# Altium project UART.PrjPCB
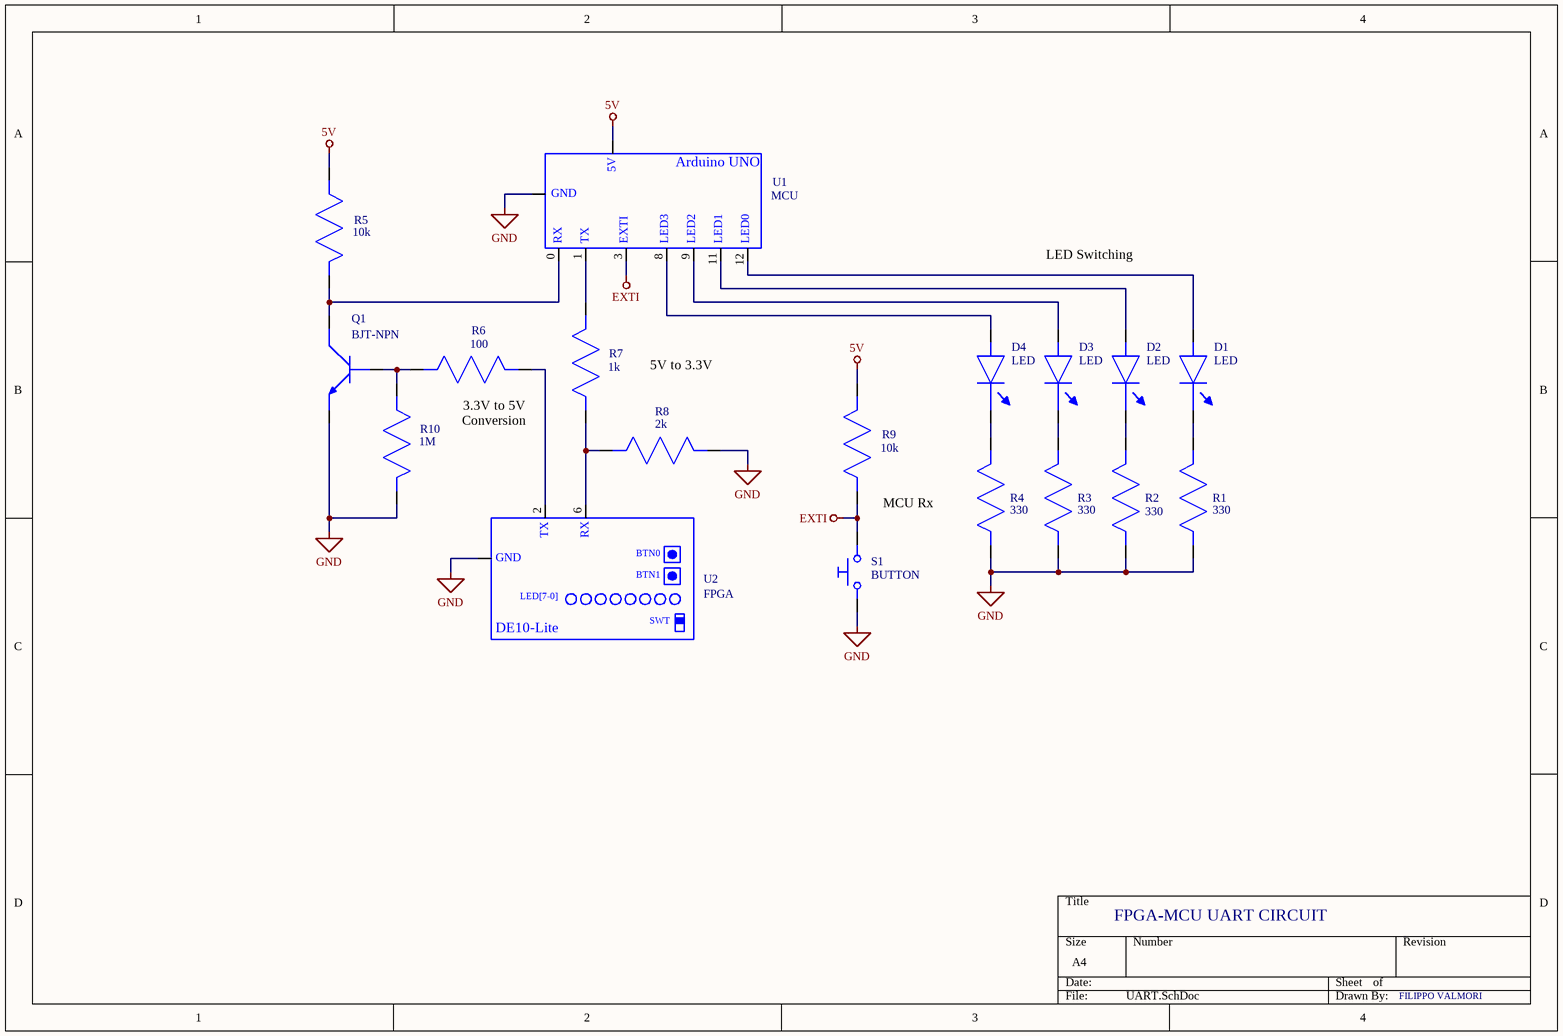
[diagram p0: UART.SchDoc]
2 sheets, 21 parts. Net scope: global (net labels, ports and power ports of the same name join across sheets).
Sheets:
  UART.SchDoc
  PUTTY.SchDoc

## Sheet UART.SchDoc
size A4

### Parts
D1  LED
D2  LED
D3  LED
D4  LED
Q1  BJT-NPN
R1  330
R2  330
R3  330
R4  330
R5  10k
R6  100
R7  1k
R8  2k
R9  10k
R10  1M
S1  BUTTON
U1  MCU
U2  FPGA

### Nets
5V: R5.2 R9.2 U1.21
EXTI: R9.1 S1.13 U1.3
GND: Q1.3 R1.1 R2.1 R3.1 R4.1 R8.2 R10.1 S1.12 U1.16 U2.3
NetD1_1: D1.1 U1.12
NetD1_2: D1.2 R1.2
NetD2_1: D2.1 U1.11
NetD2_2: D2.2 R2.2
NetD3_1: D3.1 U1.9
NetD3_2: D3.2 R3.2
NetD4_1: D4.1 U1.8
NetD4_2: D4.2 R4.2
NetQ1_1: Q1.1 R6.2 R10.2
NetQ1_2: Q1.2 R5.1 U1.0
NetR6_1: R6.1 U2.2
NetR7_1: R7.1 R8.1 U2.6
NetR7_2: R7.2 U1.1

### Notes on the sheet
- LED Switching
- 5V to 3.3V
  Conversion
- (near R6) 3.3V to 5V
  Conversion
- MCU Rx
  Reset
- FPGA-MCU UART CIRCUIT
- FILIPPO VALMORI
- (in symbol FPGA) TX; RX; BTN0; GND; BTN1; LED[7-0]; SWT; DE10-Lite
- (in symbol MCU) 5V; Arduino UNO; GND; RX; TX; EXTI; LED3; LED2; LED1; LED0

### Library data of the parts
Q1 = BJT
R1-R4 = RES330
R5 R9 = RES10K
R6 = RES100
R7 = RES1K
R8 = RES2K
R10 = RES1M
S1 = BTN

## Sheet PUTTY.SchDoc
size A4
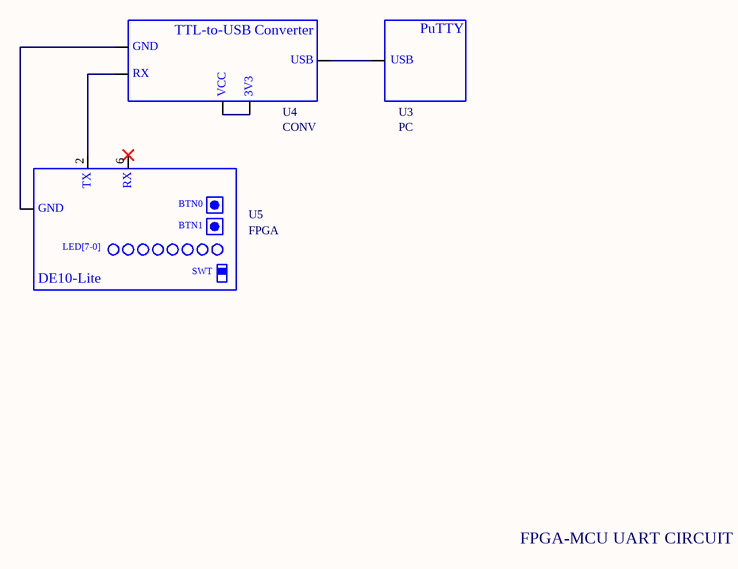
[diagram p1: PUTTY.SchDoc]

### Parts
U3  PC
U4  CONV
U5  FPGA

### Nets
NetU3_0: U3.0 U4.1
NetU4_0: U4.0 U5.3
NetU4_11: U4.11 U4.12
NetU4_16: U4.16 U5.2

Not connected (* = marked no-connect by the designer): U5 6*

### Notes on the sheet
- FPGA-MCU UART CIRCUIT
- (in symbol FPGA) TX; RX; BTN0; GND; BTN1; LED[7-0]; SWT; DE10-Lite
- (in symbol PC) PuTTY; USB
- (in symbol TTL2USB) TTL-to-USB Converter; GND; USB; RX; VCC; 3V3

### Library data of the parts
U4 = TTL2USB